# EAGLE design beluga_shield (EAGLE 5.12)
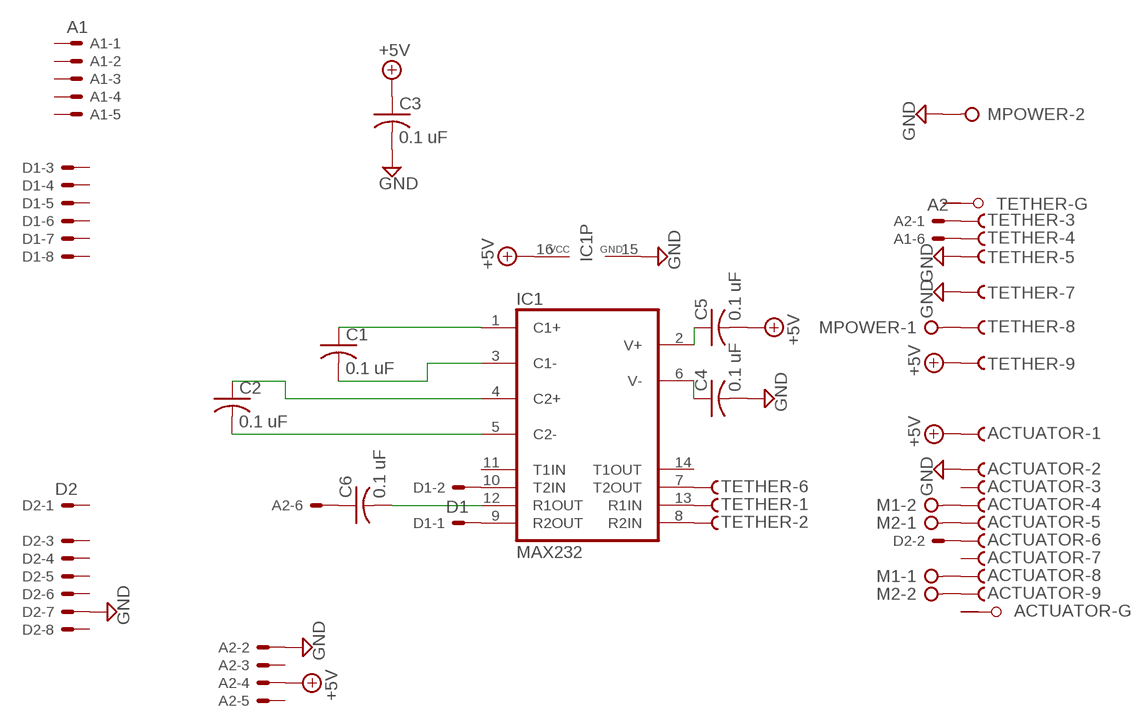
[diagram p0: schematic, sheet 1]

## Parts
A1  A1  22-23-2061  [22-23-2061]
A2  A2  22-23-2061  [22-23-2061]
ACTUATOR  F09HPS  [F09HP]
C1  0.1 uF  C-US025-025X050  [C025-025X050]
C2  0.1 uF  C-US025-025X050  [C025-025X050]
C3  0.1 uF  C-US025-025X050  [C025-025X050]
C4  0.1 uF  C-US025-025X050  [C025-025X050]
C5  0.1 uF  C-US025-025X050  [C025-025X050]
C6  0.1 uF  C-US025-025X050  [C025-025X050]
D1  D1  22-23-2081  [22-23-2081]
D2  D2  22-23-2081  [22-23-2081]
IC1  MAX232  [DIL16]
M1  W237-02P  [W237-132]
M2  W237-02P  [W237-132]
MPOWER  W237-02P  [W237-132]
TETHER  F09HPS  [F09HP]

## Nets
+5V: A2.4 ACTUATOR.1(-1:F) C3.1 C5.2 IC1.16(VCC) TETHER.9(-9:F)
GND: A2.2 ACTUATOR.2(-2:F) C3.2 C4.2 D2.7 IC1.15(GND) MPOWER.2 TETHER.5(-5:F) TETHER.7(-7:F)
N$1: C1.1 IC1.1(C1+)
N$2: C1.2 IC1.3(C1-)
N$3: C2.1 IC1.4(C2+)
N$4: C2.2 IC1.5(C2-)
N$5: D1.2 IC1.10(T2IN)
N$6: D1.1 IC1.9(R2OUT)
N$7: C6.2 IC1.12(R1OUT)
N$8: A2.6 C6.1
N$9: ACTUATOR.5(-5:F) M2.1
N$10: MPOWER.1 TETHER.8(-8:F)
N$11: ACTUATOR.6(-6:F) D2.2
N$12: A2.1 TETHER.3(-3:F)
N$13: A1.6 TETHER.4(-4:F)
N$14: IC1.13(R1IN) TETHER.1(-1:F)
N$15: IC1.8(R2IN) TETHER.2(-2:F)
N$16: IC1.7(T2OUT) TETHER.6(-6:F)
N$17: C5.1 IC1.2(V+)
N$18: C4.1 IC1.6(V-)
N$19: ACTUATOR.8(-8:F) M1.1
N$20: ACTUATOR.4(-4:F) M1.2
N$21: ACTUATOR.9(-9:F) M2.2
Unconnected: A1.1 A1.2 A1.3 A1.4 A1.5 A2.3 A2.5 ACTUATOR.3(-3:F) ACTUATOR.7(-7:F) ACTUATOR.G1(-G:G1) ACTUATOR.G2(-G:G2) D1.3 D1.4 D1.5 D1.6 D1.7 D1.8 D2.1 D2.3 D2.4 D2.5 D2.6 D2.8 IC1.11(T1IN) IC1.14(T1OUT) TETHER.G1(-G:G1) TETHER.G2(-G:G2)

## Library data of the parts
A1 A2 = shieldparts:22-23-2061: .100" (2.54mm) Center Header - 6 Pin; MF: MOLEX; MPN: 22-23-2061; OC_FARNELL: 1462922; OC_NEWARK: 27C1933
ACTUATOR TETHER = shieldparts:F09HPS: SUB-D; OC_FARNELL: unknown; OC_NEWARK: unknown
C1-C6 = rcl:C-US: CAPACITOR, American symbol
D1 D2 = shieldparts:22-23-2081: .100" (2.54mm) Center Header - 8 Pin; MF: MOLEX; MPN: 22-23-2081; OC_FARNELL: 1756826; OC_NEWARK: 01C7592
IC1 = maxim:MAX232: RS232 TRANSEIVER; MF: MAXIM; MPN: MAX232ACPE+; OC_FARNELL: 9723773; OC_NEWARK: 68K4544
M1 M2 MPOWER = shieldparts:W237-02P: WAGO SREW CLAMP; OC_FARNELL: unknown; OC_NEWARK: unknown

## Board
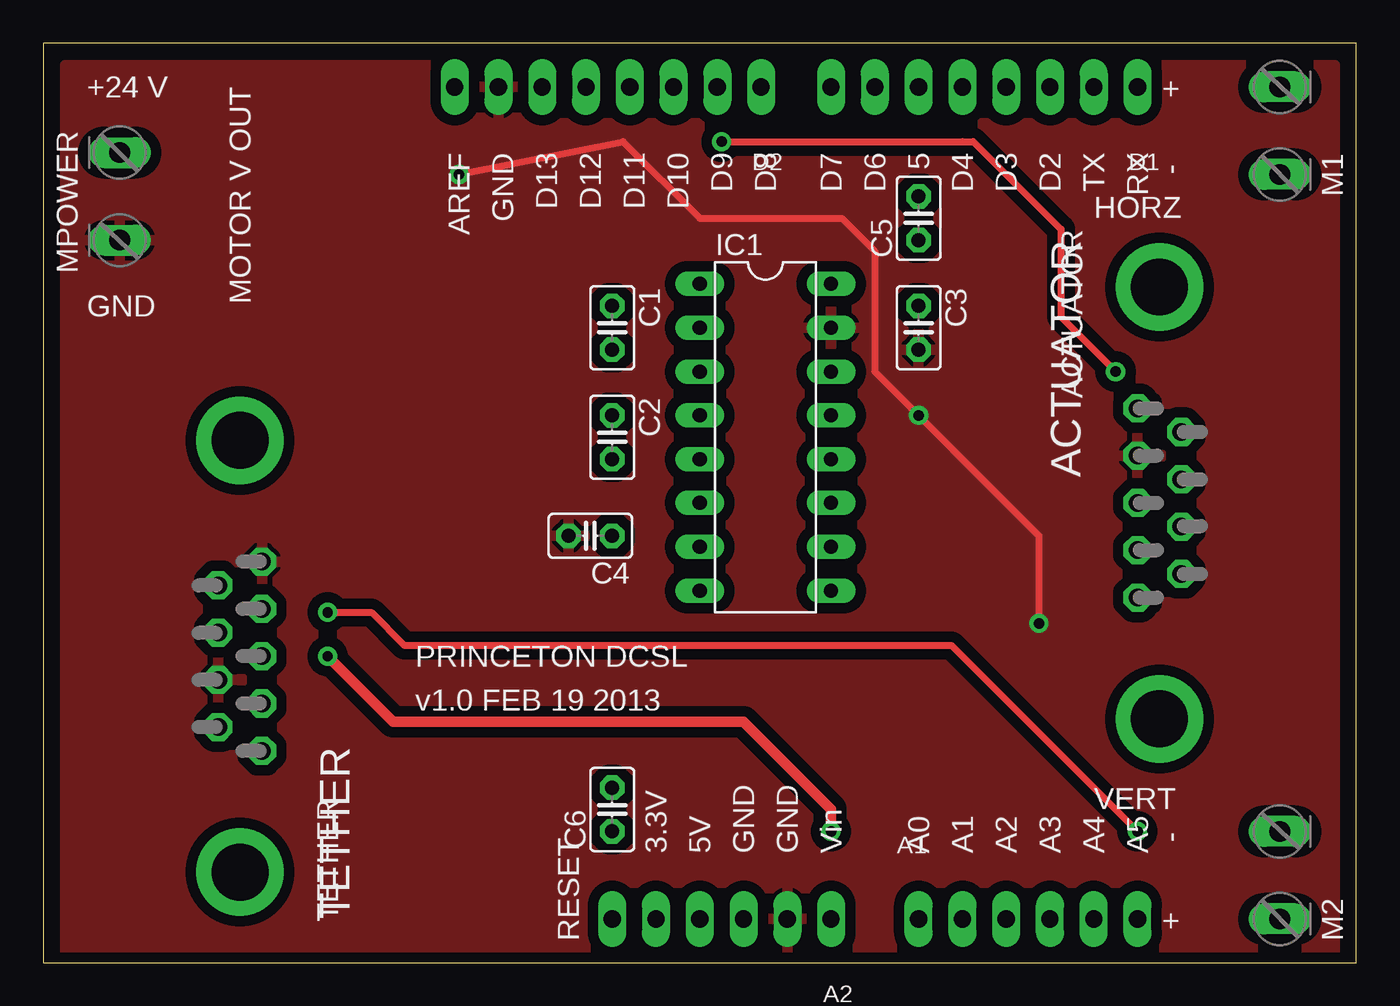
[diagram p1: board, top side]
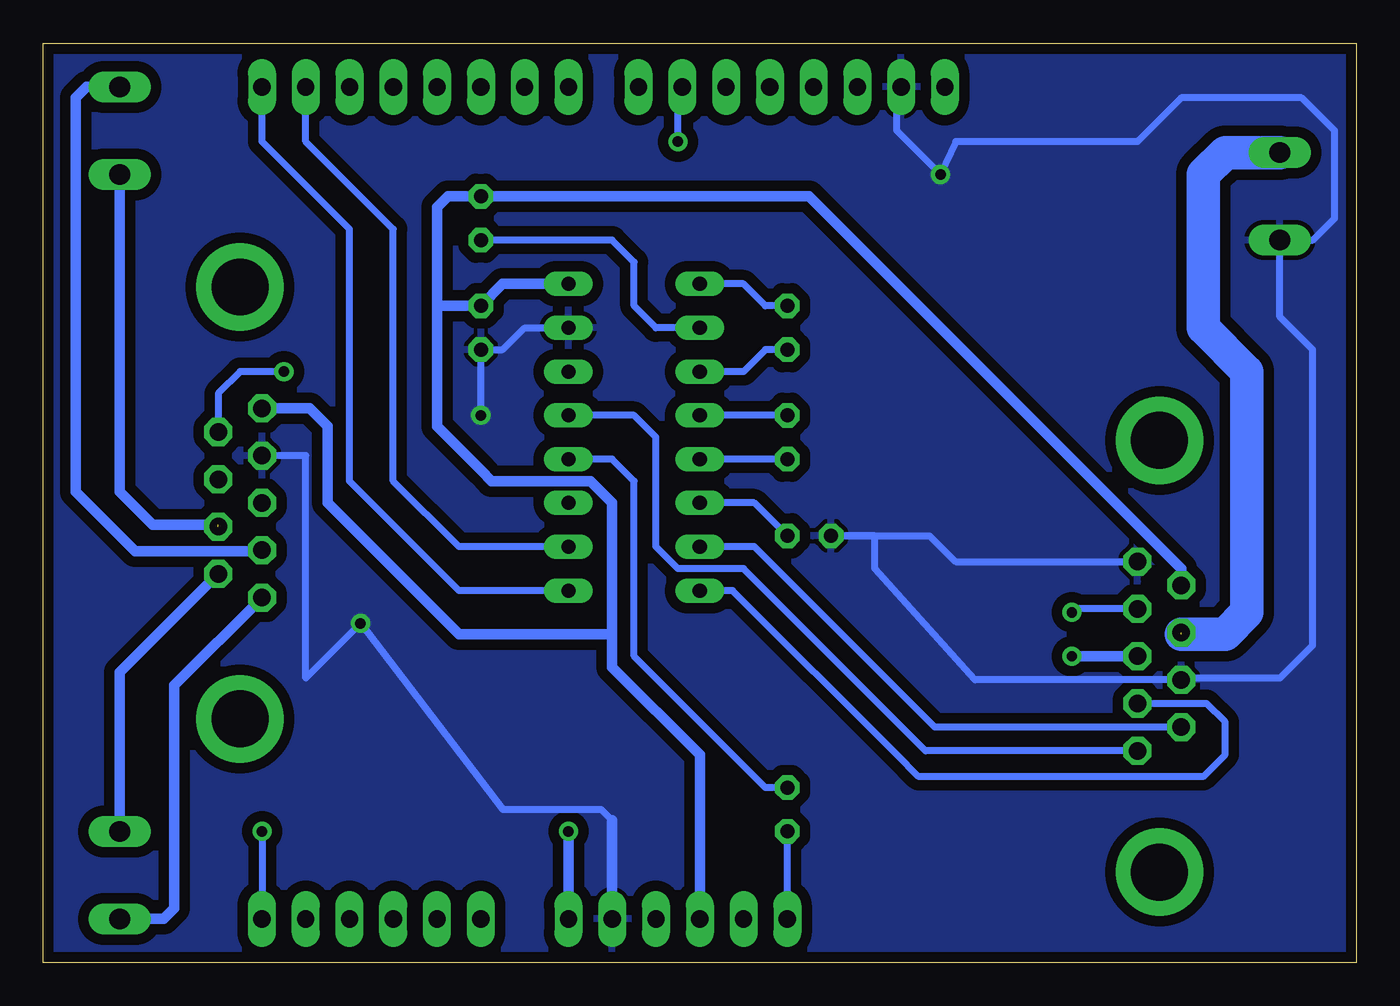
[diagram p2: board, bottom side, seen from below]

Size 76.2 x 53.34 mm. Coordinates in mm from the lower left corner, seen from the top.
Outline: 0,0 76.2,0 76.2,53.34 0,53.34 0,0
Copper layers (1*16): Top 0.0356mm / dielectric 1.5011mm / Bottom 0.0356mm
Design rules "OSHParkRules *": minimum track width 6mil, minimum drill 13mil, track to track 6mil, track to pad 6mil, pad to pad 6mil, via to via 6mil, smd to smd 6mil, copper to edge 15mil, drill to drill 6mil, minimum pad ring 12mil, minimum via ring 10mil, stop-mask expansion 4mil, vias tented up to drill 0mil, thermal gap 10mil

### Footprints (pad centres in the part's own frame; a part is rotated, then mirrored left to right if it is on the bottom)
22-23-2061 = drill 1 long: 1 -6.35,0; 2 -3.81,0; 3 -1.27,0; 4 1.27,0; 5 3.81,0; 6 6.35,0
F09HP = drill 1.016 octagon: 1 -5.486,-1.27; 2 -2.743,-1.27; 3 0,-1.27; 4 2.743,-1.27; 5 5.486,-1.27; 6 -4.115,1.27; 7 -1.372,1.27; 8 1.372,1.27; 9 4.115,1.27 | drill 3.302 pad 5.08 round: G1 -12.522,0; G2 12.522,0
C025-025X050 = drill 0.813 octagon: 1 -1.27,0; 2 1.27,0
22-23-2081 = drill 1 long: 1 -8.89,0; 2 -6.35,0; 3 -3.81,0; 4 -1.27,0; 5 1.27,0; 6 3.81,0; 7 6.35,0; 8 8.89,0
DIL16 = drill 0.813 long: 1 -8.89,-3.81; 2 -6.35,-3.81; 3 -3.81,-3.81; 4 -1.27,-3.81; 5 1.27,-3.81; 6 3.81,-3.81; 7 6.35,-3.81; 8 8.89,-3.81; 9 8.89,3.81; 10 6.35,3.81; 11 3.81,3.81; 12 1.27,3.81; 13 -1.27,3.81; 14 -3.81,3.81; 15 -6.35,3.81; 16 -8.89,3.81
W237-132 = drill 1.194 long: 1 -2.54,-0.635; 2 2.54,-0.635

### Placement (x,y rotation side)
A1  57.15,2.54 0 top
A2  39.37,2.54 180 top
ACTUATOR  64.77,26.67 270 top
C1  33.02,36.83 270 top
C2  33.02,30.48 270 top
C3  50.8,36.83 270 top
C4  31.75,24.77 180 top
C5  50.8,43.18 90 top
C6  33.02,8.89 90 top
D1  54.61,50.8 180 top
D2  32.77,50.8 180 top
IC1  41.91,30.48 270 top
M1  71.12,48.26 90 top
M2  71.12,5.08 90 top
MPOWER  5.08,44.45 270 top
TETHER  11.43,17.78 90 top

### Tracks (layer width: path | path; a pad name or v marks a point on that pad's centre or on a via)
+5V
  Bottom 0.61: 53.34,38.1 C3.1 49.53,39.37 IC1.16 | 53.34,38.1 53.34,41.27 53.34,43.81 52.7,44.45 C5.2 31.75,44.45 10.16,22.86 TETHER.9 | 53.34,38.1 53.34,31.11 50.8,28.57 50.16,27.94 44.45,27.94 43.18,26.67 43.18,20.95 43.18,19.05 | ACTUATOR.1 60.73,32.16 59.69,31.11 59.69,26.67 52.07,19.05 45.09,19.05 43.18,19.05 | A2.4 38.1,12.06 43.18,17.14 43.18,19.05
GND  (via drill 0.6)
  Top 0.406: v57.78,19.68 57.78,24.77 v50.8,31.75 48.26,34.29 48.26,41.27 46.35,43.18 38.1,43.18 33.66,47.62 v24.13,45.72
  Bottom 0.406: ACTUATOR.2 60.96,29.41 60.96,16.51 v57.78,19.68 49.53,8.89 43.81,8.89 43.18,8.26 | v50.8,31.75 C3.2 49.53,35.56 48.26,36.83 IC1.15 | TETHER.5 23.27,23.27 24.77,24.77 C4.2 27.94,24.77 27.94,22.86 22.12,16.41 TETHER.7 10.06,16.51 4.45,16.51 2.54,18.41 2.54,35.56 4.45,37.47 MPOWER.2 2.54,41.91 1.27,43.18 1.27,48.26 3.17,50.16 10.16,50.16 12.7,47.62 23.24,47.62 v24.13,45.72 26.04,47.62 26.67,48.26 26.67,50.55 D2.7
  Bottom 0.61: 43.18,8.26 A2.2
  pour Bottom (isolate 0.61): 0,53.34 76.2,53.34 76.2,0 0,0
  pour Top (isolate 0.61): 1.27,52.07 74.93,52.07 74.93,51.44 74.93,0.64 1.27,0.64
N$1
  Bottom 0.406: C1.1 34.29,38.1 35.56,39.37 IC1.1
N$2
  Bottom 0.406: C1.2 34.29,35.56 35.56,34.29 IC1.3
N$3
  Bottom 0.406: C2.1 IC1.4
N$4
  Bottom 0.406: C2.2 IC1.5
N$5
  Bottom 0.406: IC1.10 52.07,24.13 55.88,27.94 55.88,42.55 60.96,47.62 D1.2
N$6
  Bottom 0.406: IC1.9 52.07,21.59 58.42,27.94 58.42,42.55 63.5,47.62 D1.1
N$7
  Bottom 0.406: C6.2 34.29,10.16 41.91,17.78 41.91,27.94 43.18,29.21 IC1.12
N$8
  Bottom 0.406: A2.6 C6.1
N$9
  Bottom 0.61: ACTUATOR.5 68.58,16.1 68.58,3.81 68.58,3.17 69.22,2.54 M2.1
N$10  (1 unrouted)
  Bottom 1.93: MPOWER.1 7.62,46.99 8.89,45.72 8.89,45.09 8.89,36.83 6.35,34.29 6.35,20.32 7.62,19.05 8.26,19.05 10.16,19.05
N$11  (via drill 0.6)
  Top 0.406: v39.37,47.62 53.34,47.62 53.98,47.62 59.05,42.55 59.05,37.47 v62.23,34.29
  Bottom 0.406: D2.2 39.37,50.8 v39.37,47.62 | v62.23,34.29 64.77,34.29 66.04,33.02 ACTUATOR.6
N$12  (via drill 0.6)
  Top 0.61: v45.72,7.62 45.72,8.89 40.64,13.97 20.32,13.97 v16.51,17.78
  Bottom 0.61: TETHER.3 v16.51,17.78 | v45.72,7.62 A2.1
N$13  (via drill 0.6)
  Top 0.406: v16.51,20.32 19.05,20.32 20.95,18.41 52.7,18.41 v63.5,7.62
  Bottom 0.406: v63.5,7.62 A1.6 | TETHER.4 16.31,20.52 v16.51,20.32
N$14
  Bottom 0.406: TETHER.1 24.99,12.29 35.56,22.86 39.37,22.86 40.64,24.13 40.64,30.48 41.91,31.75 IC1.13
N$15
  Bottom 0.406: TETHER.2 8.69,15.04 7.62,13.97 7.62,12.06 8.89,10.79 25.4,10.79 26.67,12.06 36.2,21.59 IC1.8
N$16
  Bottom 0.406: IC1.7 34.92,24.13 24.46,13.66 TETHER.6
N$17
  Bottom 0.406: IC1.2 40.64,36.83 41.91,38.1 41.91,40.64 43.18,41.91 C5.1
N$18
  Bottom 0.406: IC1.6 34.92,26.67 C4.1
N$19  (1 unrouted)
  Bottom 0.61: 66.04,25.4 69.85,25.4 71.75,27.3 M1.1
N$20
  Bottom 0.61: M1.2 73.66,50.8 74.3,50.16 74.3,49.53 74.3,27.3 70.87,23.88 63.5,23.88 ACTUATOR.4
N$21
  Bottom 0.61: M2.2 71.75,16.84 ACTUATOR.9

### Text on the board
tPlace: MOTOR V OUT | +24 V | + | AREF | GND | D13 | D12 | D11 | D10 | D9 | D8 | D7 | D6 | 5 | D4 | D3 | D2 | TX | RX | - | ACTUATOR | HORZ | GND | PRINCETON DCSL | v1.0 FEB 19 2013 | TETHER | VERT | - | 3.3V | 5V | GND | GND | Vin | A0 | A1 | A2 | A3 | A4 | A5 | + | RESET